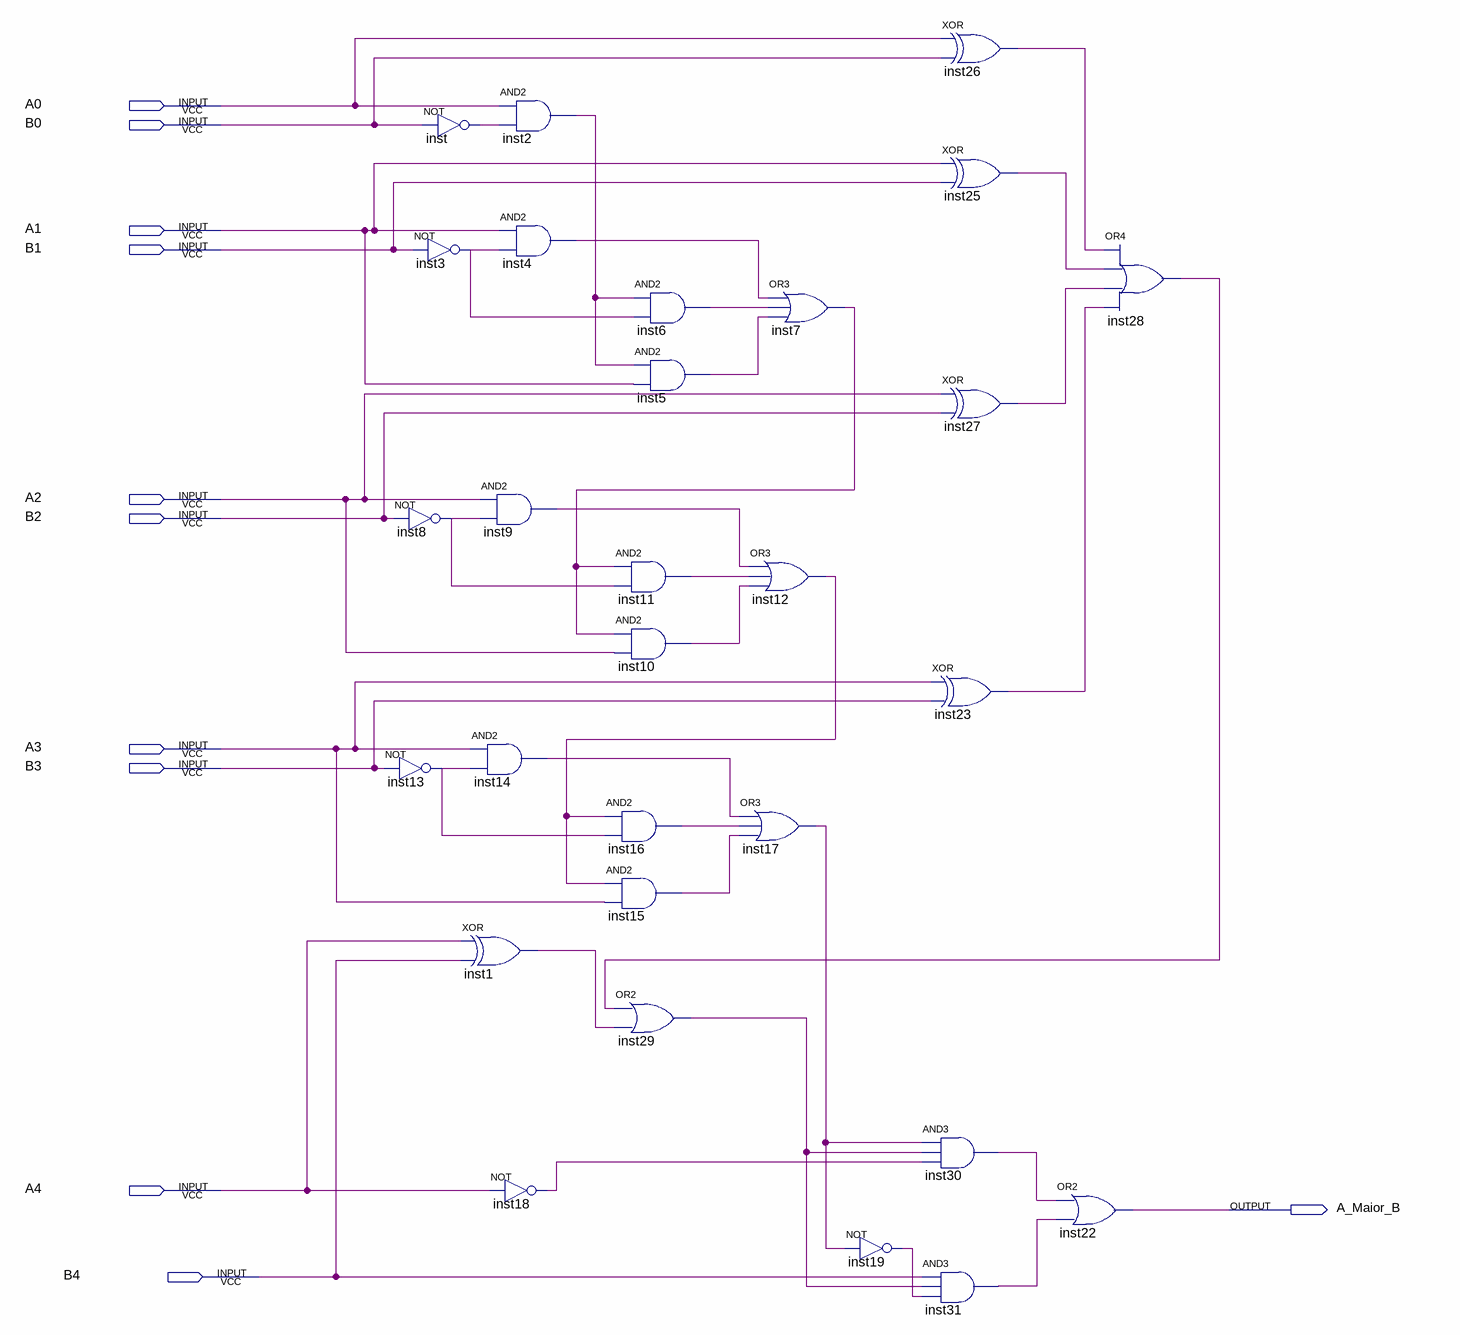
[diagram p0: schematic sheet]
// Quartus schematic A_Maior_B.bdf as structural Verilog: 29 symbols, 11 pins
module A_Maior_B (
  input  A0,
  input  B0,
  input  A1,
  input  B1,
  input  A2,
  input  B2,
  input  A3,
  input  B3,
  input  A4,
  input  B4,
  output A_Maior_B
);

  wire inst1_out, inst2_out, inst3_out, inst4_out, inst5_out, inst6_out, inst7_out, inst8_out, inst9_out,
       inst10_out, inst11_out, inst12_out, inst13_out, inst14_out, inst15_out, inst16_out, inst17_out,
       inst18_out, inst19_out, inst23_out, inst25_out, inst26_out, inst27_out, inst28_out, inst29_out,
       inst30_out, inst31_out, inst_out;

  not inst13 (inst13_out, B3);
  not inst (inst_out, B0);
  not inst3 (inst3_out, B1);
  not inst8 (inst8_out, B2);
  xor inst1 (inst1_out, A4, B4);
  and inst2 (inst2_out, A0, inst_out);
  and inst4 (inst4_out, A1, inst3_out);
  and inst9 (inst9_out, A2, inst8_out);
  and inst14 (inst14_out, A3, inst13_out);
  not inst18 (inst18_out, A4);
  and inst11 (inst11_out, inst7_out, inst8_out);
  and inst10 (inst10_out, inst7_out, A2);
  and inst16 (inst16_out, inst12_out, inst13_out);
  and inst15 (inst15_out, inst12_out, A3);
  or inst29 (inst29_out, inst28_out, inst1_out);
  and inst6 (inst6_out, inst2_out, inst3_out);
  and inst5 (inst5_out, inst2_out, A1);
  or inst7 (inst7_out, inst4_out, inst6_out, inst5_out);
  or inst12 (inst12_out, inst9_out, inst11_out, inst10_out);
  or inst17 (inst17_out, inst14_out, inst16_out, inst15_out);
  not inst19 (inst19_out, inst17_out);
  and inst30 (inst30_out, inst17_out, inst29_out, inst18_out);
  and inst31 (inst31_out, B4, inst29_out, inst19_out);
  xor inst26 (inst26_out, A0, B0);
  xor inst25 (inst25_out, A1, B1);
  xor inst27 (inst27_out, A2, B2);
  xor inst23 (inst23_out, A3, B3);
  or inst22 (A_Maior_B, inst30_out, inst31_out);
  or inst28 (inst28_out, inst26_out, inst25_out, inst27_out, inst23_out);
endmodule
